# Altium project PCB_Project.PrjPcb
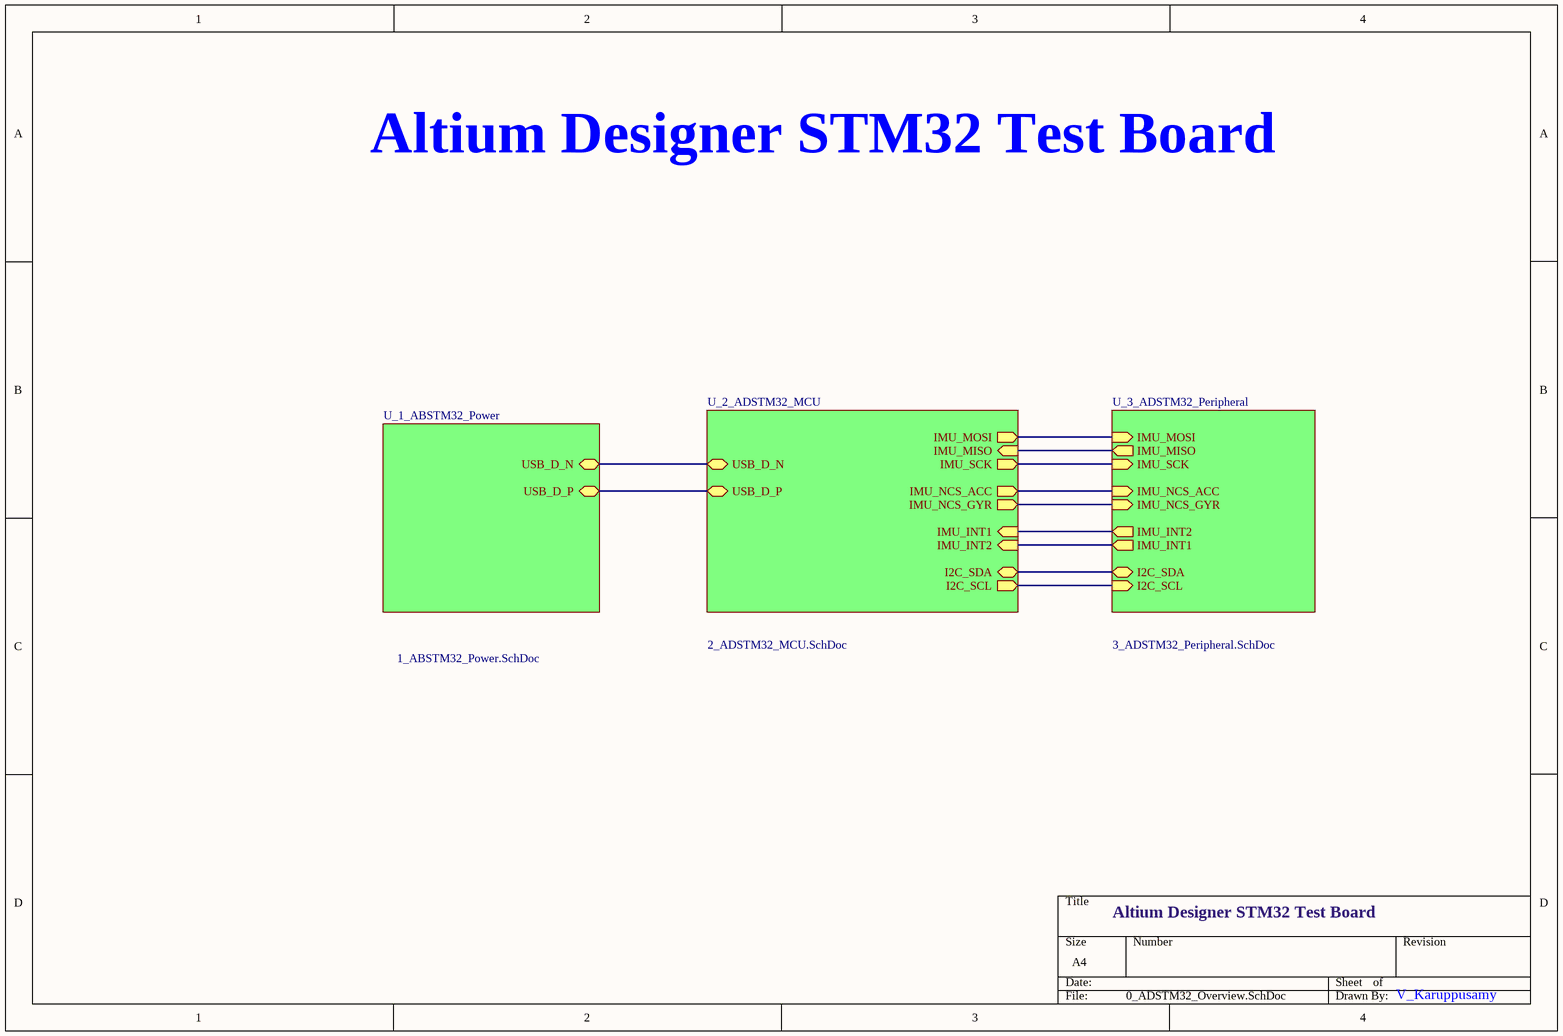
[diagram p0: 0_ADSTM32_Overview.SchDoc]
4 sheets, 30 parts. Net scope: hierarchical (ports join the sheet entries above them; power ports are global).
Board file: AD_STM32_PCB.PcbDoc
Sheets:
  0_ADSTM32_Overview.SchDoc
    U_1_ABSTM32_Power = 1_ABSTM32_Power.SchDoc
    U_3_ADSTM32_Peripheral = 3_ADSTM32_Peripheral.SchDoc
    U_2_ADSTM32_MCU = 2_ADSTM32_MCU.SchDoc

## Sheet 0_ADSTM32_Overview.SchDoc
size A4; SheetNumber: 1; SheetTotal: 4

### Sub-sheets
U_1_ABSTM32_Power = 1_ABSTM32_Power.SchDoc: USB_D_N (bidir), USB_D_P (bidir)
U_2_ADSTM32_MCU = 2_ADSTM32_MCU.SchDoc: USB_D_N (bidir), USB_D_P (bidir), IMU_SCK (out), IMU_NCS_ACC (out), IMU_NCS_GYR (out), IMU_MOSI (out), IMU_MISO (in), I2C_SCL (out), I2C_SDA (bidir), IMU_INT1 (in), IMU_INT2 (in)
U_3_ADSTM32_Peripheral = 3_ADSTM32_Peripheral.SchDoc: IMU_SCK (in), IMU_MOSI (in), IMU_NCS_ACC (in), IMU_NCS_GYR (in), IMU_MISO (out), IMU_INT1 (out), IMU_INT2 (out), I2C_SCL (in), I2C_SDA (bidir)

### Nets
I2C_SCL: sheet U_3_ADSTM32_Peripheral/I2C_SCL, sheet U_2_ADSTM32_MCU/I2C_SCL
I2C_SDA: sheet U_3_ADSTM32_Peripheral/I2C_SDA, sheet U_2_ADSTM32_MCU/I2C_SDA
IMU_INT1: sheet U_3_ADSTM32_Peripheral/IMU_INT1, sheet U_2_ADSTM32_MCU/IMU_INT2
IMU_INT2: sheet U_3_ADSTM32_Peripheral/IMU_INT2, sheet U_2_ADSTM32_MCU/IMU_INT1
IMU_MISO: sheet U_3_ADSTM32_Peripheral/IMU_MISO, sheet U_2_ADSTM32_MCU/IMU_MISO
IMU_MOSI: sheet U_3_ADSTM32_Peripheral/IMU_MOSI, sheet U_2_ADSTM32_MCU/IMU_MOSI
IMU_NCS_ACC: sheet U_3_ADSTM32_Peripheral/IMU_NCS_ACC, sheet U_2_ADSTM32_MCU/IMU_NCS_ACC
IMU_NCS_GYR: sheet U_3_ADSTM32_Peripheral/IMU_NCS_GYR, sheet U_2_ADSTM32_MCU/IMU_NCS_GYR
IMU_SCK: sheet U_3_ADSTM32_Peripheral/IMU_SCK, sheet U_2_ADSTM32_MCU/IMU_SCK
USB_D_N: sheet U_1_ABSTM32_Power/USB_D_N, sheet U_2_ADSTM32_MCU/USB_D_N
USB_D_P: sheet U_1_ABSTM32_Power/USB_D_P, sheet U_2_ADSTM32_MCU/USB_D_P

### Notes on the sheet
- Altium Designer STM32 Test Board
- V_Karuppusamy

## Sheet 1_ABSTM32_Power.SchDoc
size A4; SheetNumber: 2; SheetTotal: 4
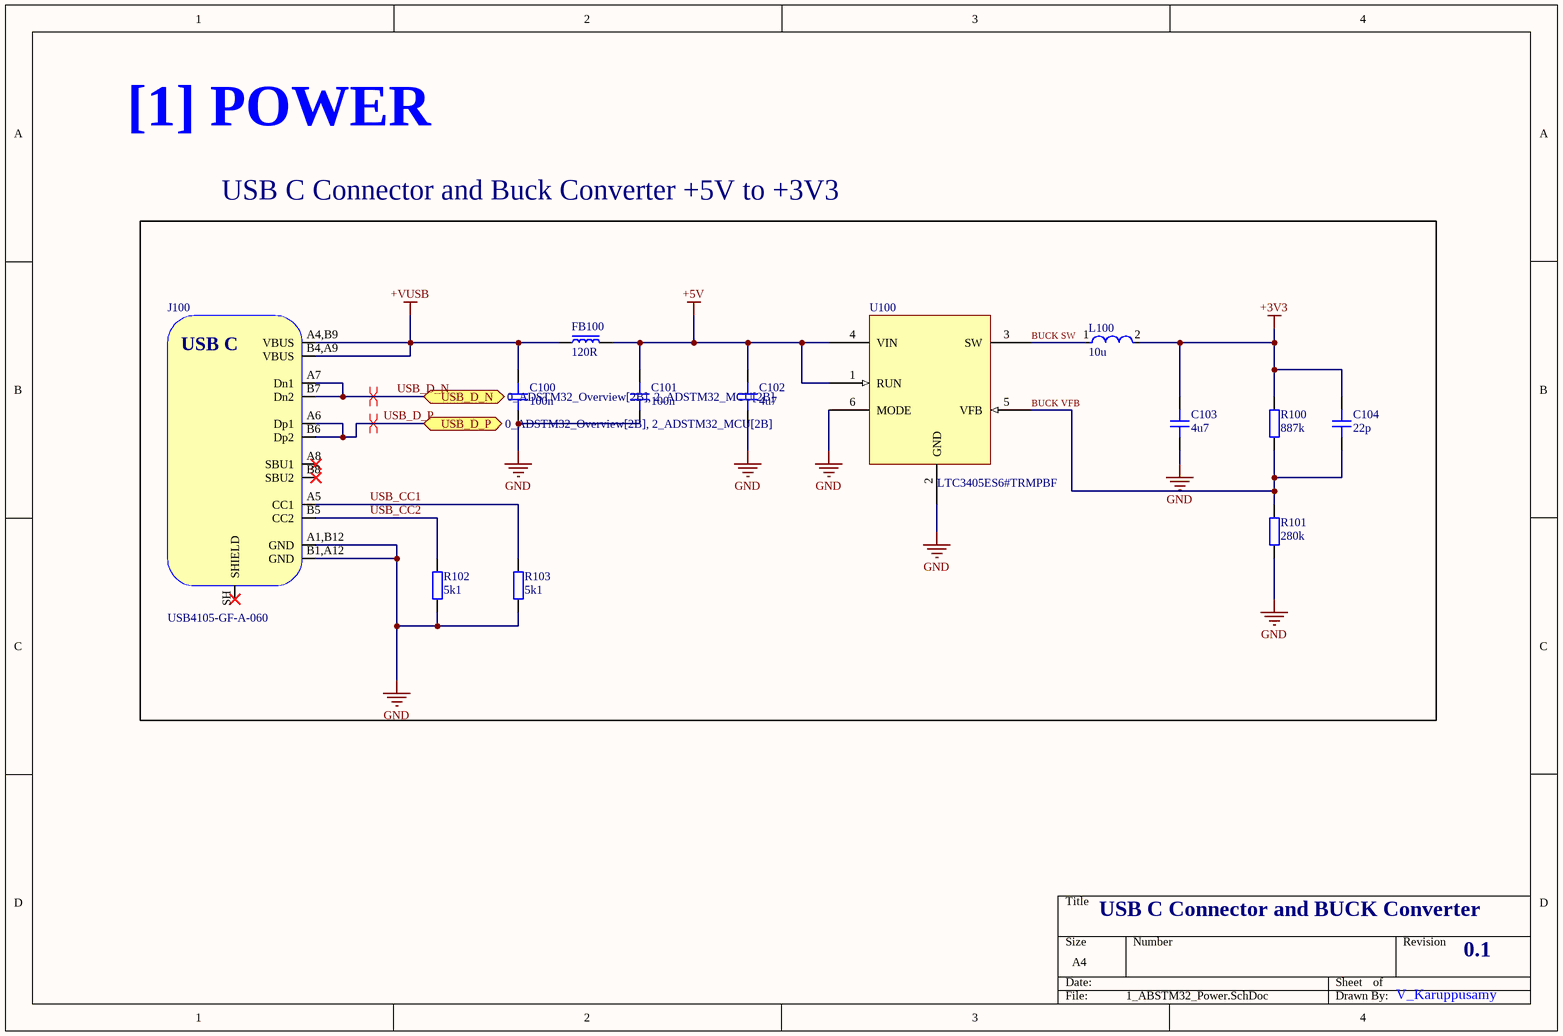
[diagram p1: 1_ABSTM32_Power.SchDoc]

### Parts
C100  100n  [CAP_0805]
C101  100n  [CAP_0805]
C102  4u7  [CAP_0805]
C103  4u7  [CAP_0805]
C104  22p  [CAP_0201]
FB100  120R  [FB_0402]
J100  USB4105-GF-A-060  [USB4105-GF-A-060]
L100  10u  [FP-NRH2412-MFG]
R100  887k  [RES_0603]
R101  280k  [RES_0603]
R102  5k1  [RES_0603]
R103  5k1  [RES_0603]
U100  LTC3405ES6#TRMPBF  [SOT-23-6]

### Blocks framed on the sheet
USB C Connector and Buck Converter +5V to +3V3: C100-C104 FB100 J100 L100 R100-R103 U100

### Ports
USB_D_N (bidir, see 0_ADSTM32_Overview[2B], 2_ADSTM32_MCU[2B]), USB_D_P (bidir, see 0_ADSTM32_Overview[2B], 2_ADSTM32_MCU[2B])

### Nets
+3V3: C103.2 C104.2 L100.2 R100.2
+5V: C101.2 C102.2 FB100.2 U100.1(RUN) U100.4(VIN)
+VUSB: C100.2 FB100.1 J100.A4,B9(VBUS) J100.B4,A9(VBUS)
GND: C100.1 C101.1 C102.1 C103.1 J100.A1,B12(GND) J100.B1,A12(GND) R101.1 R102.1 R103.1 U100.2(GND) U100.6(MODE)
BUCK SW: L100.1 U100.3(SW)
BUCK VFB: C104.1 R100.1 R101.2 U100.5(VFB)
USB_CC1: J100.A5(CC1) R103.2
USB_CC2: J100.B5(CC2) R102.2
USB_D_N: J100.A7(Dn1) J100.B7(Dn2) ; port USB_D_N
USB_D_P: J100.A6(Dp1) J100.B6(Dp2) ; port USB_D_P

Not connected (* = marked no-connect by the designer): J100 A8(SBU1)* B8(SBU2)* SH(SHIELD)*

### Layout directives
differential pair; differential pair class *: USB_D_N, USB_D_P

### Notes on the sheet
- [1] POWER
- USB C Connector and BUCK Converter
- 0.1
- V_Karuppusamy
- (in symbol USB4105-GF-A-060) USB C

### Library data of the parts
C100-C104 = CAP_0805_16V: Capacitor SMD 0805 16V
FB100 = FB_0402: Ferrite Bead SMD 0402
J100 = USB4105-GF-A-060: USB Connector Type C SMT 12 Pin; Manufacturer: GCT; Manufacturer Part Number: USB4105-GF-A-060
L100 = CMP-14484-000582-1: Shielded Wirewound Inductor 10uH 20% 0.51A 0.72Ω SMD; DC Resistance (DCR): 600mR; Current Rating: 450mA; Saturation Current: 810mA; Core Material: Ferrite; Test Frequency: 100kHz; Self Resonant Frequency: 29MHz; Termination: SMD/SMT; Shielding: Shielded; Height - Seated (Max): 0.047inch; Case/Package: Nonstandard; Tolerance: 20%; Height: 1.2mm; Package Quantity: 2500; Mount: Surface Mount; Min Operating Temperature: -25°C; Inductance: 10uH; Width: 0.095inch; Length: 0.095inch; RoHS Compliant: Yes; Max DC Current: 810mA; Packaging: Tape and Reel; Max Operating Temperature: 120°C; Halogen Free: Halogen Free
R100-R103 = RES_0603: Resistor SMD 0603; Manufacturer: *; Manufacturer Part Number: *; Distributor Link: *
U100 = LTC3405ES6#TRMPBF: 1.5MHz, 300mA / Synchronous Step-Down / Regulator in ThinSOT; Manufacture: Analogdevices; Manufacture Part Number: LTC3405ES6#TRMPBF

## Sheet 3_ADSTM32_Peripheral.SchDoc
size A4; SheetNumber: 4; SheetTotal: 4
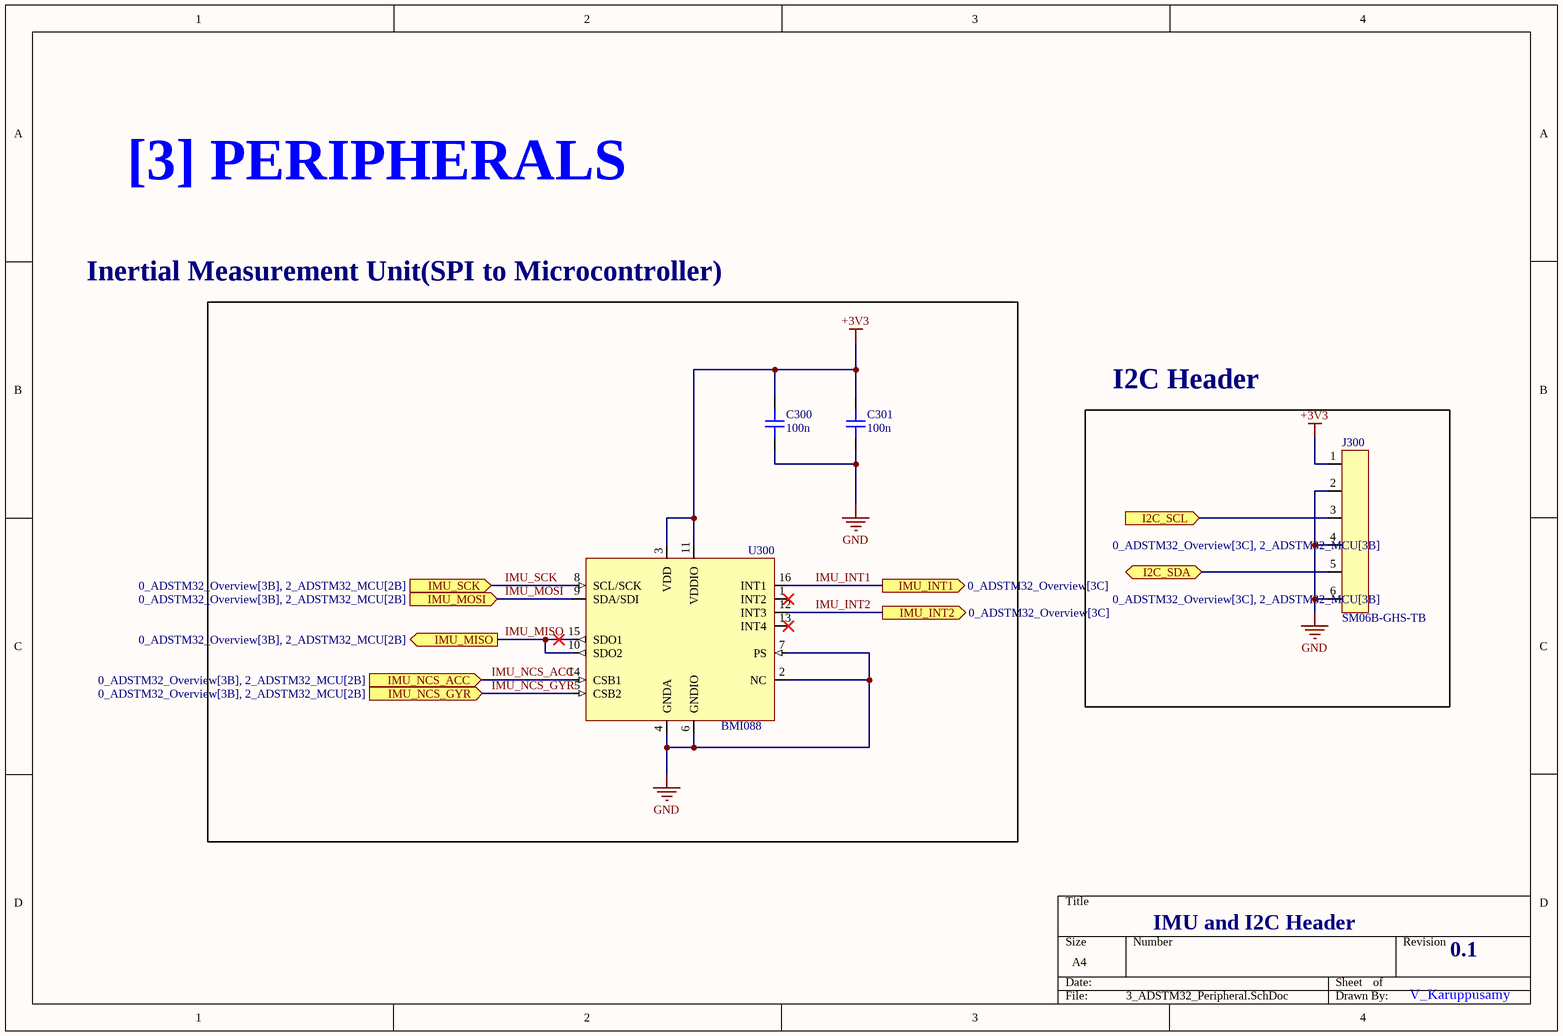
[diagram p2: 3_ADSTM32_Peripheral.SchDoc]

### Parts
C300  100n  [CAP_0805]
C301  100n  [CAP_0805]
J300  SM06B-GHS-TB  [SM06B-GHS-TB]
U300  BMI088  [BMI088]

### Blocks framed on the sheet
I2C Header: J300

### Ports
I2C_SCL (in, see 0_ADSTM32_Overview[3C], 2_ADSTM32_MCU[3B]), I2C_SDA (bidir, see 0_ADSTM32_Overview[3C], 2_ADSTM32_MCU[3B]), IMU_INT1 (out, see 0_ADSTM32_Overview[3C]), IMU_INT2 (out, see 0_ADSTM32_Overview[3C]), IMU_MISO (out, see 0_ADSTM32_Overview[3B], 2_ADSTM32_MCU[2B]), IMU_MOSI (in, see 0_ADSTM32_Overview[3B], 2_ADSTM32_MCU[2B]), IMU_NCS_ACC (in, see 0_ADSTM32_Overview[3B], 2_ADSTM32_MCU[2B]), IMU_NCS_GYR (in, see 0_ADSTM32_Overview[3B], 2_ADSTM32_MCU[2B]), IMU_SCK (in, see 0_ADSTM32_Overview[3B], 2_ADSTM32_MCU[2B])

### Nets
+3V3: C300.2 C301.2 J300.1 U300.3(VDD) U300.11(VDDIO)
GND: C300.1 C301.1 J300.2 J300.4 J300.6 U300.2(NC) U300.4(GNDA) U300.6(GNDIO) U300.7(PS)
I2C_SCL: J300.3 ; port I2C_SCL
I2C_SDA: J300.5 ; port I2C_SDA
IMU_INT1: U300.16(INT1) ; port IMU_INT1
IMU_INT2: U300.12(INT3) ; port IMU_INT2
IMU_MISO: U300.10(SDO2) U300.15(SDO1) ; port IMU_MISO
IMU_MOSI: U300.9(SDA/SDI) ; port IMU_MOSI
IMU_NCS_ACC: U300.14(CSB1) ; port IMU_NCS_ACC
IMU_NCS_GYR: U300.5(CSB2) ; port IMU_NCS_GYR
IMU_SCK: U300.8(SCL/SCK) ; port IMU_SCK

Not connected (* = marked no-connect by the designer): U300 1(INT2)* 13(INT4)*

### Notes on the sheet
- [3] PERIPHERALS
- Inertial Measurement Unit(SPI to Microcontroller)
- IMU and I2C Header
- 0.1
- V_Karuppusamy

### Library data of the parts
C300 C301 = CAP_0805_16V: Capacitor SMD 0805 16V
J300 = SM06B-GHS-TB: Header Connector 6 Position 1.25MM Pitch SMD Horizontal JST GH; Manufacturer: JST; Manufacturer Part Number: SM06B-GHS-TB
U300 = BMI088: Inertial Measurement Unit IMU 6-Axis LGA; Manufacturer: Bosch; Manufacturer Part Number: BMI088

## Sheet 2_ADSTM32_MCU.SchDoc
size A4; SheetNumber: 3; SheetTotal: 4
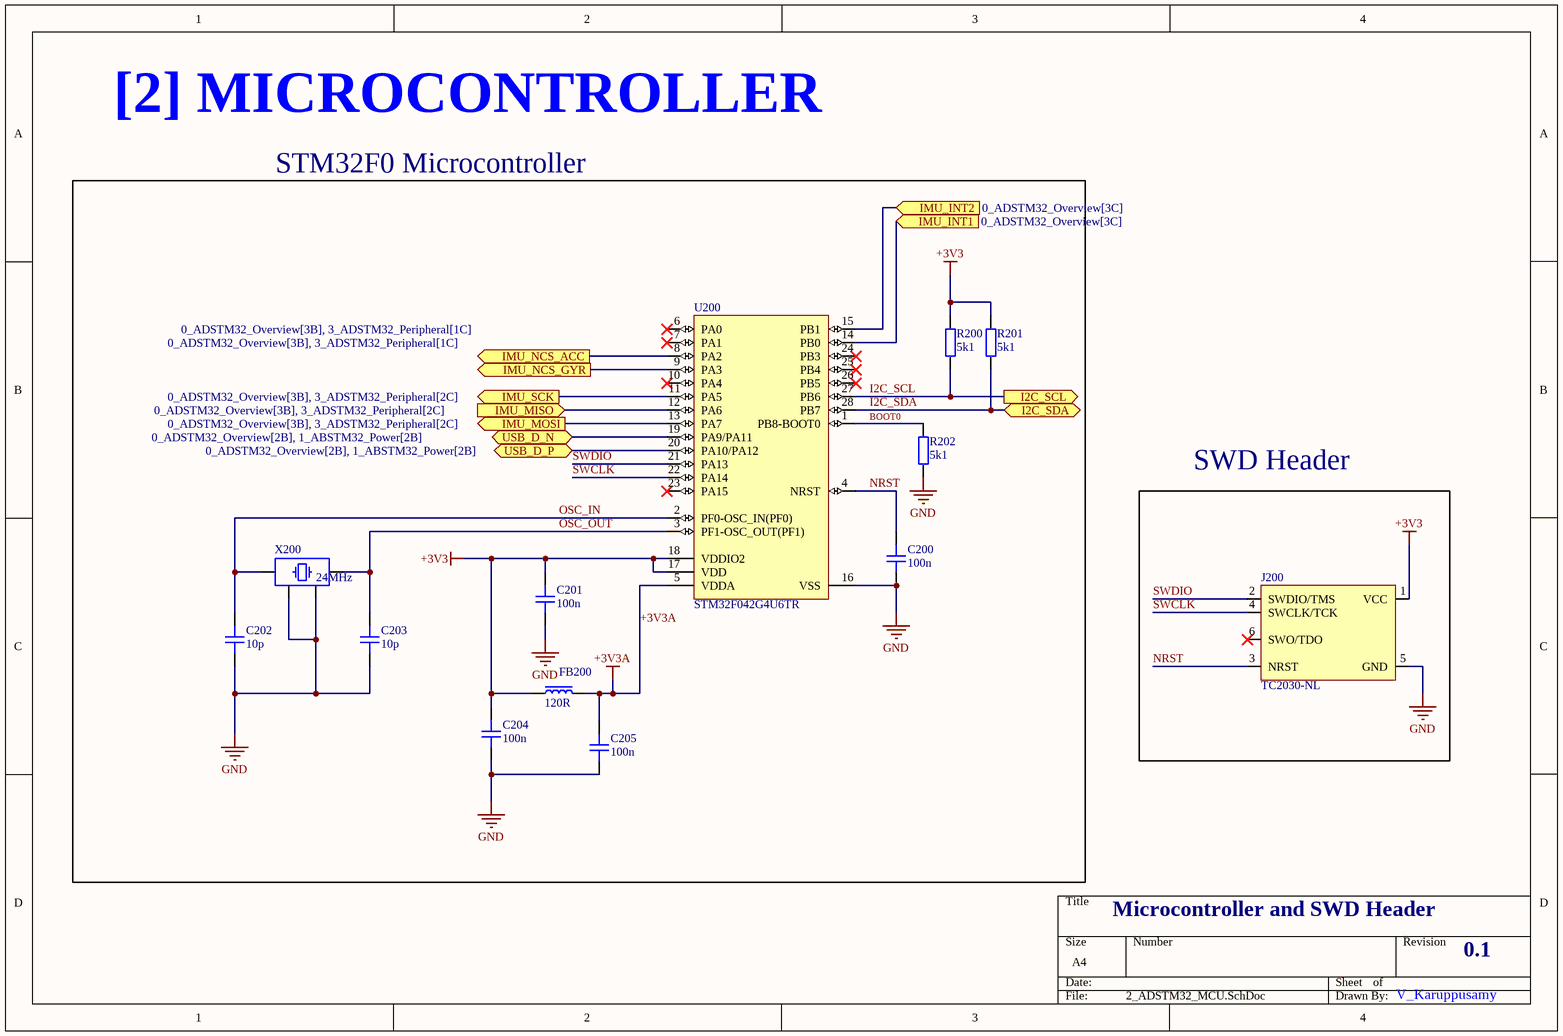
[diagram p3: 2_ADSTM32_MCU.SchDoc]

### Parts
C200  100n  [CAP_0805]
C201  100n  [CAP_0805]
C202  10p  [CAP_0805]
C203  10p  [CAP_0805]
C204  100n  [CAP_0805]
C205  100n  [CAP_0805]
FB200  120R  [FB_0402]
J200  TC2030-NL  [TC2030-NL-FP]  (no BOM)
R200  5k1  [RES_0603]
R201  5k1  [RES_0603]
R202  5k1  [RES_0603]
U200  STM32F042G4U6TR  [STM-UFQFPN28_V]
X200  24MHz  [XTAL_3225]

### Blocks framed on the sheet
STM32F0 Microcontroller: C200-C205 FB200 R200-R202 U200 X200
SWD Header: J200

### Ports
I2C_SCL (out), I2C_SDA (bidir), IMU_INT1 (in, see 0_ADSTM32_Overview[3C]), IMU_INT2 (in, see 0_ADSTM32_Overview[3C]), IMU_MISO (in, see 0_ADSTM32_Overview[3B], 3_ADSTM32_Peripheral[2C]), IMU_MOSI (out, see 0_ADSTM32_Overview[3B], 3_ADSTM32_Peripheral[2C]), IMU_NCS_ACC (out, see 0_ADSTM32_Overview[3B], 3_ADSTM32_Peripheral[1C]), IMU_NCS_GYR (out, see 0_ADSTM32_Overview[3B], 3_ADSTM32_Peripheral[1C]), IMU_SCK (out, see 0_ADSTM32_Overview[3B], 3_ADSTM32_Peripheral[2C]), USB_D_N (bidir, see 0_ADSTM32_Overview[2B], 1_ABSTM32_Power[2B]), USB_D_P (bidir, see 0_ADSTM32_Overview[2B], 1_ABSTM32_Power[2B])

### Nets
+3V3: C201.2 C204.2 FB200.1 J200.1(VCC) R200.2 R201.2 U200.17(VDD) U200.18(VDDIO2)
+3V3A: C205.2 FB200.2 U200.5(VDDA)
GND: C200.1 C201.1 C202.1 C203.1 C204.1 C205.1 J200.5(GND) R202.1 U200.16(VSS) X200.2 X200.4
BOOT0: R202.2 U200.1(PB8-BOOT0)
I2C_SCL: R200.1 U200.27(PB6) ; port I2C_SCL
I2C_SDA: R201.1 U200.28(PB7) ; port I2C_SDA
IMU_INT1: U200.15(PB1) ; port IMU_INT2
IMU_INT2: U200.14(PB0) ; port IMU_INT1
IMU_MISO: U200.12(PA6) ; port IMU_MISO
IMU_MOSI: U200.13(PA7) ; port IMU_MOSI
IMU_NCS_ACC: U200.8(PA2) ; port IMU_NCS_ACC
IMU_NCS_GYR: U200.9(PA3) ; port IMU_NCS_GYR
IMU_SCK: U200.11(PA5) ; port IMU_SCK
NRST: C200.2 J200.3(NRST) U200.4(NRST)
OSC_IN: C202.2 U200.2(PF0-OSC_IN(PF0)) X200.1
OSC_OUT: C203.2 U200.3(PF1-OSC_OUT(PF1)) X200.3
SWCLK: J200.4(SWCLK/TCK) U200.22(PA14)
SWDIO: J200.2(SWDIO/TMS) U200.21(PA13)
USB_D_N: U200.19(PA9/PA11) ; port USB_D_N
USB_D_P: U200.20(PA10/PA12) ; port USB_D_P

Not connected (* = marked no-connect by the designer): J200 6(SWO/TDO)*; U200 6(PA0)* 7(PA1)* 10(PA4)* 23(PA15)* 24(PB3)* 25(PB4)* 26(PB5)*

### Notes on the sheet
- [2] MICROCONTROLLER
- Microcontroller and SWD Header
- 0.1
- V_Karuppusamy

### Library data of the parts
C200-C205 = CAP_0805_16V: Capacitor SMD 0805 16V
FB200 = FB_0402: Ferrite Bead SMD 0402
J200 = TC2030-NL: Tag-Connect No-Solder SWD Debug Connector (No Legs) DO NOT PLACE; Manufacturer: Tag-Connect; Manufacturer Part Number: TC2030-NL-FP
R200-R202 = RES_0603: Resistor SMD 0603; Manufacturer: *; Manufacturer Part Number: *; Distributor Link: *
U200 = CMP-0304-00110-4: ARM Cortex-M0 32-bit MCU, 16 KB Flash, 6 KB Internal RAM, 24 I/Os, 28-Pin UFQFPN, -40 to 85 degC, Tape and Reel; Manufacturer: STMicroelectronics; Internal RAM Size (kB): 6; Supply Voltage(Vcc) min (V): 2; I/Os (High Current): 24; Operating Frequency(F) (Processor speed) (MHz): 48; FLASH Size (Prog) (kB): 16; PartNumber: STM32F042G4U6TR; Package Reference: UFQFPN28; Package Description: 28-Pin Ultra Thin Fine Pitch Quad Flat No-Lead, 4 x 4 x 0.6 mm Body, 0.5 mm Pitch; ComponentLink1Description: Manufacturer URL; Packing: Tape and Reel; Core: ARM Cortex-M0; ComponentLink1URL: http://www.st.com/; DatasheetVersion: Rev. 5; ComponentLink2URL: http://www.st.com/st-web-ui/static/active/en/resource/technical/document/datasheet/DM00105814.pdf; Mounting Technology: Surface Mount; ComponentLink2Description: Datasheet
X200 = TSX-3225_24.0000MF15X-AC: Crystal SMD 24MHz 10PPM 7pF 3225; Manufacturer: Epson; Manufacturer Number: TSX-3225 24.0000MF15X-AC; ESR: 40R; Value: 24MHz; Type: XTAL; Load Capacitance: 7pF

## Nets that join several sheets
+3V3: 1_ABSTM32_Power (C103.2 C104.2 L100.2 R100.2), 3_ADSTM32_Peripheral (5 pins), 2_ADSTM32_MCU (8 pins)
GND: 1_ABSTM32_Power (11 pins), 3_ADSTM32_Peripheral (9 pins), 2_ADSTM32_MCU (11 pins)
I2C_SCL: 3_ADSTM32_Peripheral (J300.3), 2_ADSTM32_MCU (R200.1 U200.27)
I2C_SDA: 3_ADSTM32_Peripheral (J300.5), 2_ADSTM32_MCU (R201.1 U200.28)
IMU_INT1: 3_ADSTM32_Peripheral (U300.16), 2_ADSTM32_MCU (U200.15)
IMU_INT2: 3_ADSTM32_Peripheral (U300.12), 2_ADSTM32_MCU (U200.14)
IMU_MISO: 3_ADSTM32_Peripheral (U300.10 U300.15), 2_ADSTM32_MCU (U200.12)
IMU_MOSI: 3_ADSTM32_Peripheral (U300.9), 2_ADSTM32_MCU (U200.13)
IMU_NCS_ACC: 3_ADSTM32_Peripheral (U300.14), 2_ADSTM32_MCU (U200.8)
IMU_NCS_GYR: 3_ADSTM32_Peripheral (U300.5), 2_ADSTM32_MCU (U200.9)
IMU_SCK: 3_ADSTM32_Peripheral (U300.8), 2_ADSTM32_MCU (U200.11)
USB_D_N: 1_ABSTM32_Power (J100.A7 J100.B7), 2_ADSTM32_MCU (U200.19)
USB_D_P: 1_ABSTM32_Power (J100.A6 J100.B6), 2_ADSTM32_MCU (U200.20)